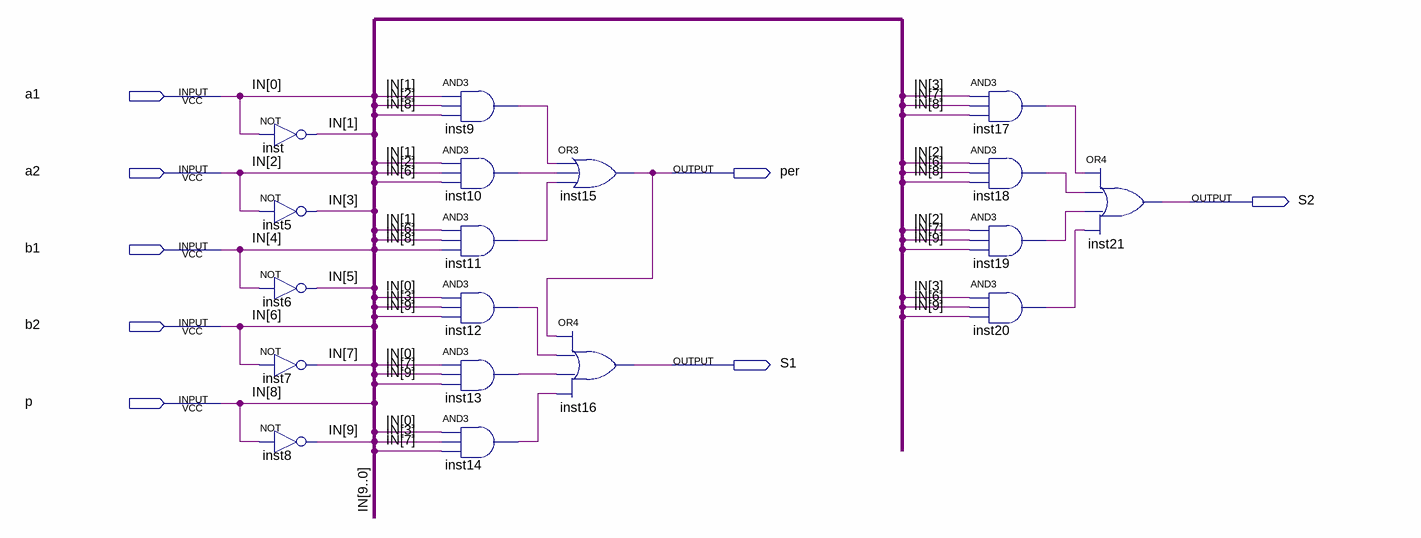
[diagram p0: schematic sheet]
// Quartus schematic OCHS.bdf as structural Verilog: 18 symbols, 8 pins
module OCHS (
  input  a1,
  input  a2,
  input  b1,
  input  b2,
  input  p,
  output per,
  output S2,
  output S1
);

  wire inst9_out, inst10_out, inst11_out, inst12_out, inst13_out, inst14_out, inst17_out, inst18_out,
       inst19_out, inst20_out;
  wire [9:1] IN;

  not inst (IN[1], a1);
  not inst5 (IN[3], a2);
  not inst6 (IN[5], b1);
  not inst7 (IN[7], b2);
  not inst8 (IN[9], p);
  and inst9 (inst9_out, IN[1], a2, p);
  and inst10 (inst10_out, IN[1], a2, b2);
  and inst11 (inst11_out, IN[1], b2, p);
  and inst12 (inst12_out, a1, IN[3], IN[9]);
  and inst13 (inst13_out, a1, IN[7], IN[9]);
  and inst14 (inst14_out, a1, IN[3], IN[7]);
  or inst15 (per, inst9_out, inst10_out, inst11_out);
  or inst16 (S1, per, inst12_out, inst13_out, inst14_out);
  and inst17 (inst17_out, IN[3], IN[7], p);
  and inst18 (inst18_out, a2, b2, p);
  and inst19 (inst19_out, a2, IN[7], IN[9]);
  and inst20 (inst20_out, IN[3], b2, IN[9]);
  or inst21 (S2, inst17_out, inst18_out, inst19_out, inst20_out);

  // Other names for the same wires on the sheet: IN (some bits) = {p, b2, b1, a2, a1}
endmodule
